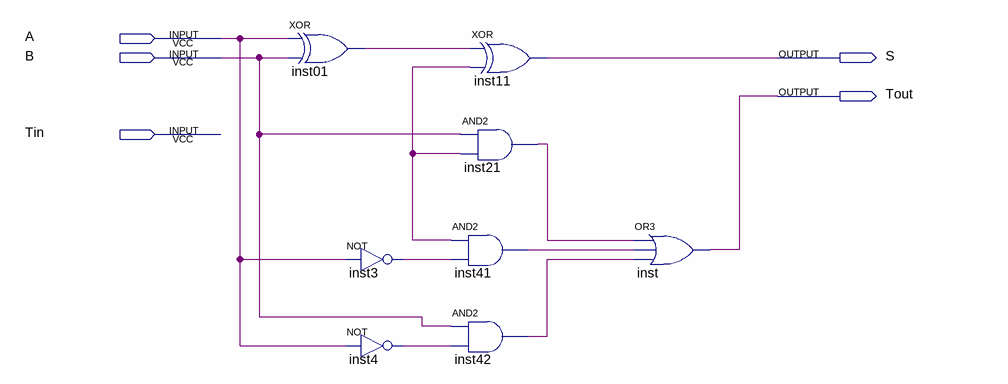
[diagram p0: schematic sheet]
// Quartus schematic 5_subtrator1bit.bdf as structural Verilog: 8 symbols, 5 pins
module \5_subtrator1bit  (
  input  A,
  input  B,
  input  Tin,
  output S,
  output Tout
);

  wire inst01_out, inst3_out, inst4_out, inst21_out, inst41_out, inst42_out, undriven;

  xor inst01 (inst01_out, A, B);
  not inst3 (inst3_out, A);
  not inst4 (inst4_out, A);
  xor inst11 (S, inst01_out, undriven);
  and inst21 (inst21_out, B, undriven);
  and inst41 (inst41_out, undriven, inst3_out);
  and inst42 (inst42_out, B, inst4_out);
  or inst (Tout, inst21_out, inst41_out, inst42_out);
endmodule
